# EAGLE design ImageProc2_ver_22 (EAGLE 5.10)
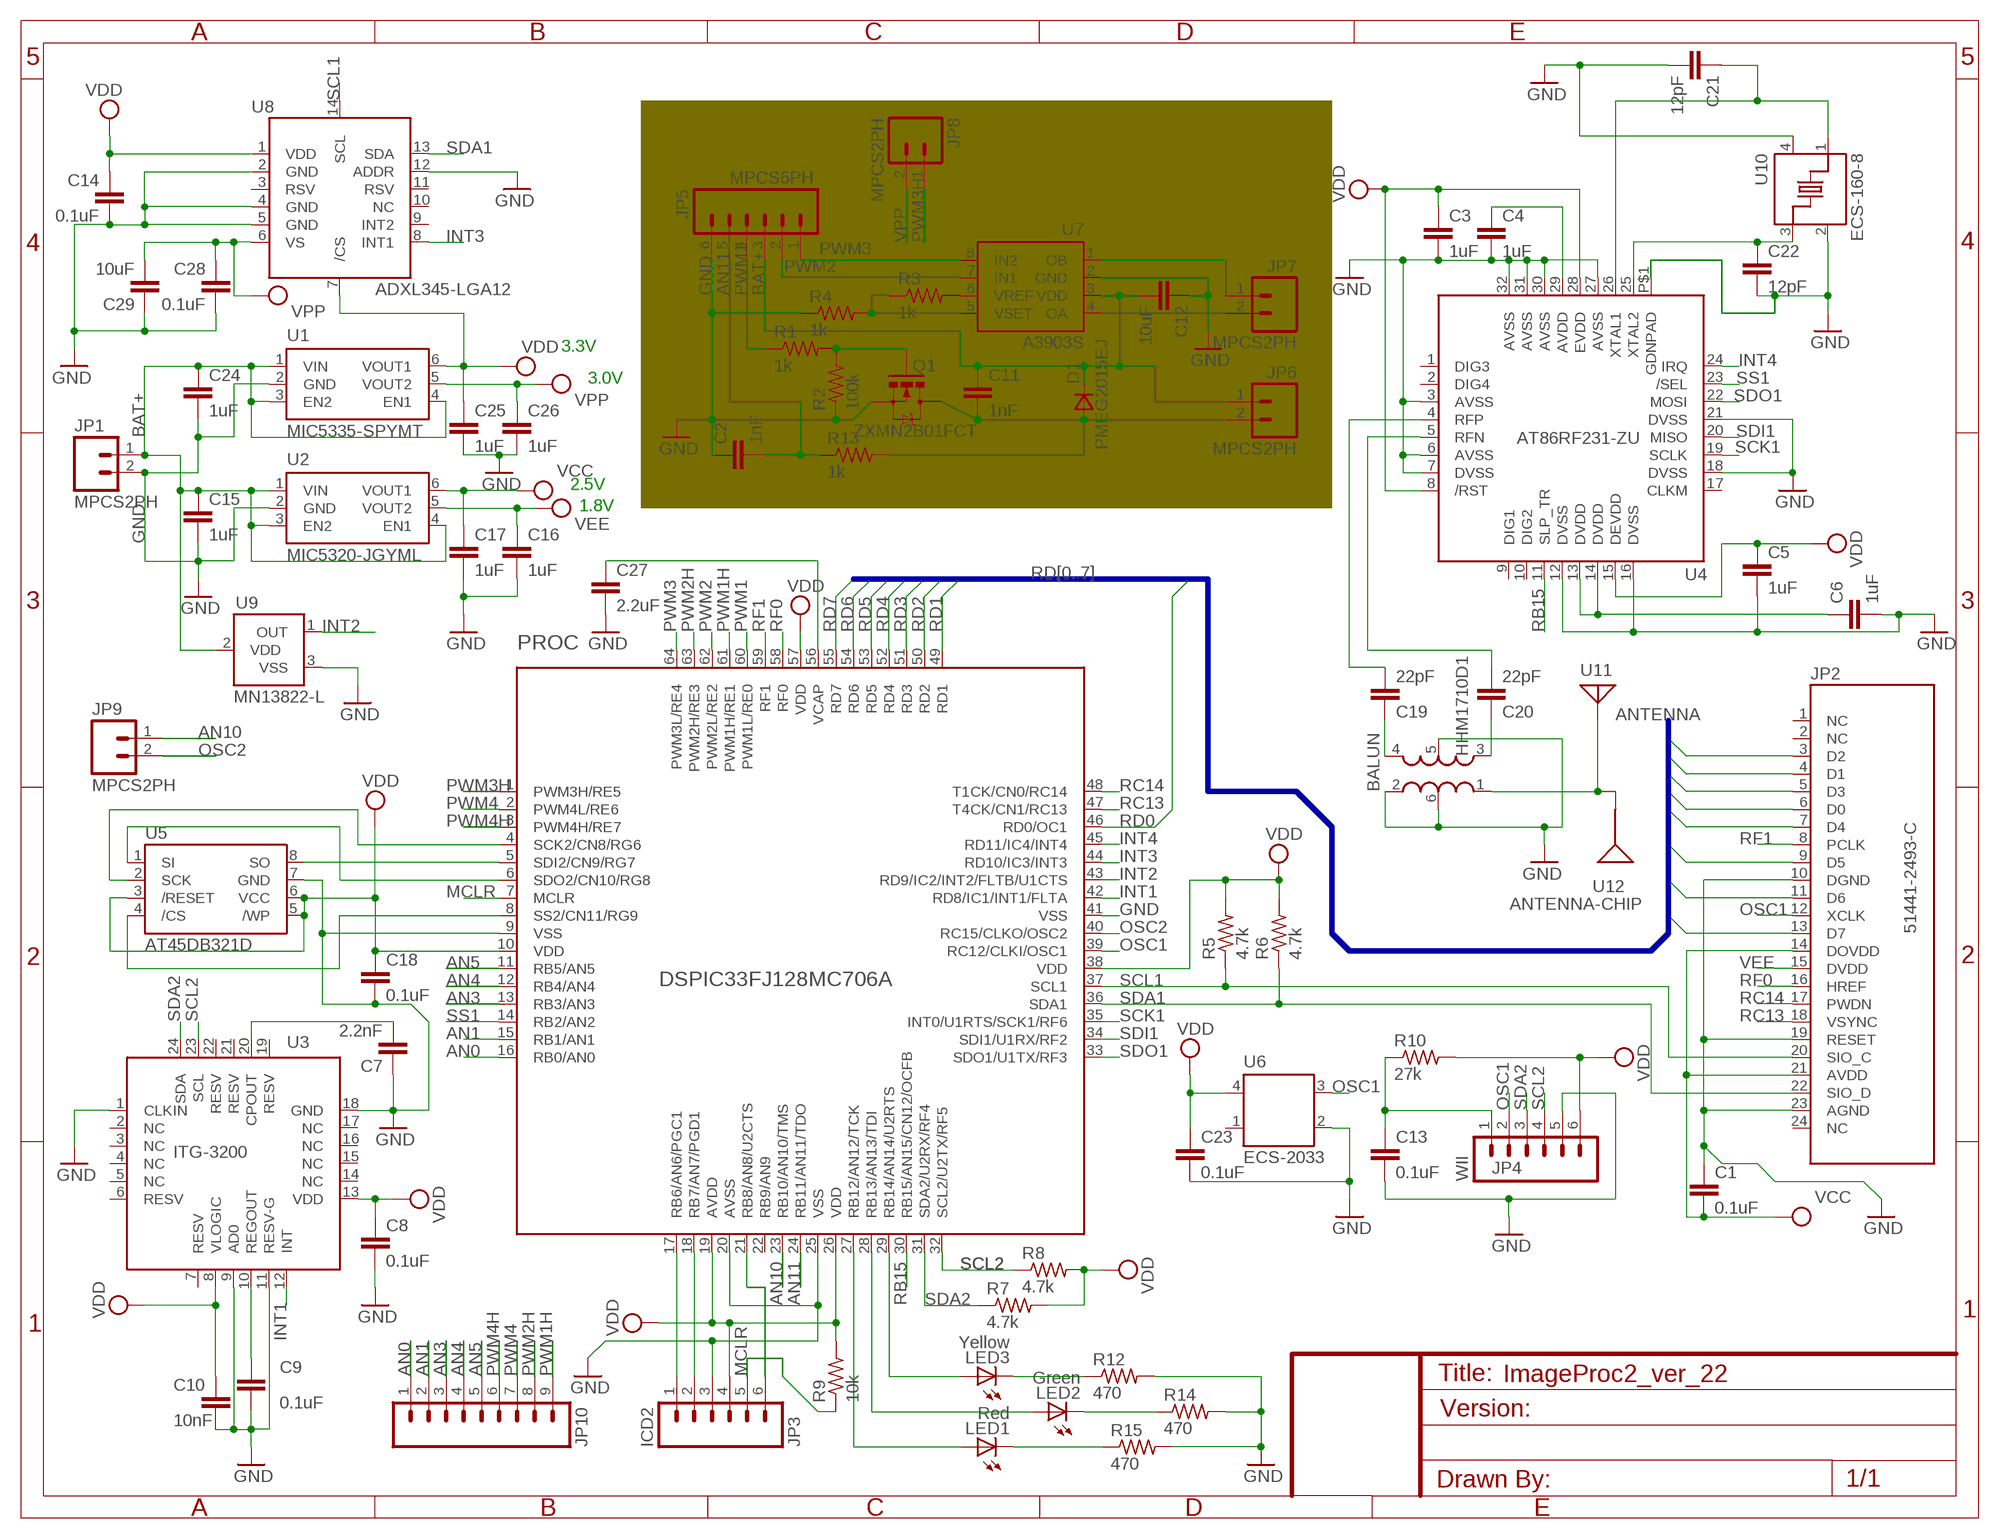
[diagram p0: schematic, sheet 1]

## Parts
BALUN  HHM1710D1  BALUNA  [BALUN]
C1  0.1uF  CAP0402-CAP  [0402-CAP]
C2  1nF  CAP0402-CAP  [0402-CAP]
C3  1uF  CAP0402-CAP  [0402-CAP]
C4  1uF  CAP0402-CAP  [0402-CAP]
C5  1uF  CAP0402-CAP  [0402-CAP]
C6  1uF  CAP0402-CAP  [0402-CAP]
C7  2.2nF  CAP0402-CAP  [0402-CAP]
C8  0.1uF  CAP0402-CAP  [0402-CAP]
C9  0.1uF  CAP0402-CAP  [0402-CAP]
C10  10nF  CAP0402-CAP  [0402-CAP]
C11  1nF  CAP0402-CAP  [0402-CAP]
C12  10uF  CAP0603-CAP  [0603-CAP]
C13  0.1uF  CAP0402-CAP  [0402-CAP]
C14  0.1uF  CAP0402-CAP  [0402-CAP]
C15  1uF  CAP0402-CAP  [0402-CAP]
C16  1uF  CAP0402-CAP  [0402-CAP]
C17  1uF  CAP0402-CAP  [0402-CAP]
C18  0.1uF  CAP0402-CAP  [0402-CAP]
C19  22pF  CAP0402-CAP  [0402-CAP]
C20  22pF  CAP0402-CAP  [0402-CAP]
C21  12pF  CAP0402-CAP  [0402-CAP]
C22  12pF  CAP0402-CAP  [0402-CAP]
C23  0.1uF  CAP0402-CAP  [0402-CAP]
C24  1uF  CAP0402-CAP  [0402-CAP]
C25  1uF  CAP0402-CAP  [0402-CAP]
C26  1uF  CAP0402-CAP  [0402-CAP]
C27  2.2uF  CAP0402-CAP  [0402-CAP]
C28  0.1uF  CAP0402-CAP  [0402-CAP]
C29  10uF  CAP0603-CAP  [0603-CAP]
D1  PMEG2015EJ  DSOD323  [SOD323]
JP1  MPCS2PH  [MOLEX-PICO_CLASP_S2P]
JP2  51441-2493-C  OV7660FSL_CON-24  [MOLEX-52740-2490]
JP3  ICD2  MPCS6PH  [MOLEX-PICO_CLASP_S6P]
JP4  WII  MPCS6PH  [MOLEX-PICO_CLASP_S6P]
JP5  MPCS6PH  [MOLEX-PICO_CLASP_S6P]
JP6  MPCS2PH  [MOLEX-PICO_CLASP_S2P]
JP7  MPCS2PH  [MOLEX-PICO_CLASP_S2P]
JP8  MPCS2PH  [MOLEX-PICO_CLASP_S2P]
JP9  MPCS2PH  [MOLEX-PICO_CLASP_S2P]
JP10  SOLDER_PADS_9P  [SOLDER_PADS_9P]
LED1  Red  LEDCHIP-LED0603  [CHIP-LED0603]
LED2  Green  LEDCHIP-LED0603  [CHIP-LED0603]
LED3  Yellow  LEDCHIP-LED0603  [CHIP-LED0603]
PROC  DSPIC33FJ128MC706A  DSPIC33FJ128MC706-I/PT  [TQFP64]
Q1  ZXMN2B01FCT  MOSFET-NCHANNELSMD  [SOT23-3]
R1  1k  R-US_R0402  [R0402]
R2  100k  R-US_R0402  [R0402]
R3  1k  R-US_R0402  [R0402]
R4  1k  R-US_R0402  [R0402]
R5  4.7k  R-US_R0402  [R0402]
R6  4.7k  R-US_R0402  [R0402]
R7  4.7k  R-US_R0402  [R0402]
R8  4.7k  R-US_R0402  [R0402]
R9  10k  R-US_R0402  [R0402]
R10  27k  R-US_R0402  [R0402]
R12  470  R-US_R0402  [R0402]
R13  1k  R-US_R0402  [R0402]
R14  470  R-US_R0402  [R0402]
R15  470  R-US_R0402  [R0402]
U1  MIC5335-SPYMT  MIC5320-JGYML  [MLF-6]
U2  MIC5320-JGYML  [MLF-6]
U3  ITG-3200  ITG-3200-00  [QFN-24]
U4  AT86RF231-ZU  [QFN-32]
U5  AT45DB321D  [MLF(VDFN)-8]
U6  ECS-2033  OSCILLATORS  [OSCILLATOR-SMD]
U7  A3903S  [DFN-8]
U8  ADXL345-LGA12  ADXL345  [LGA14]
U9  MN13822-L  VOL_DETECTOR  [SOT-23-3]
U10  ECS-160-8  CRYSTALS  [CRYSTAL-SMD]
U11  ANTENNA  [ANTENNA_PAD]
U12  ANTENNA-CHIP  [ANTENNA-CHIP]

## Nets
AN0: JP10.1 PROC.16(RB0/AN0)
AN1: JP10.2 PROC.15(RB1/AN1)
AN3: JP10.3 PROC.13(RB3/AN3)
AN4: JP10.4 PROC.12(RB4/AN4)
AN5: JP10.5 PROC.11(RB5/AN5)
AN10: JP9.1 PROC.23(RB10/AN10/TMS)
AN11: C2.2 JP5.5 PROC.24(RB11/AN11/TDO) R13.1
BAT+ [sup]: C11.1 C12.2 C15.1 C24.1 D1.1(C) JP1.1 JP5.3 JP6.1 U1.1(VIN) U1.3(EN2) U1.4(EN1) U2.1(VIN) U2.3(EN2) U2.4(EN1) U7.3(VDD) U9.2(VDD)
GND [sup]: BALUN.2(RFGND) BALUN.5(GND) BALUN.6(NC) C1.1 C2.1 C3.2 C4.2 C5.2 C6.2 C7.1 C8.2 C9.2 C10.2 C12.1 C13.2 C14.2 C15.2 C16.2 C17.2 C18.2 C21.2 C22.2 C23.2 C24.2 C25.2 C26.2 C27.2 C28.2 C29.1 JP1.2 JP2.10(DGND) JP2.19(RESET) JP2.23(AGND) JP3.3 JP4.5 JP5.6 PROC.9(VSS) PROC.20(AVSS) PROC.25(VSS) PROC.41(VSS) Q1.2(S) R2.1 R4.1 R12.2 R14.2 R15.2 U1.2(GND) U2.2(GND) U3.1(CLKIN) U3.9(AD0) U3.11(RESV-G) U3.18(GND) U4.3(AVSS) U4.6(AVSS) U4.7(DVSS) U4.12(DVSS) U4.16(DVSS) U4.18(DVSS) U4.21(DVSS) U4.27(AVSS) U4.30(AVSS) U4.31(AVSS) U4.32(AVSS) U4.P$1(GDNPAD) U5.7(GND) U6.2(GND) U7.2(GND) U8.2(GND) U8.4(GND) U8.5(GND) U8.12(ADDR) U9.3(VSS) U10.2(GND) U10.4(GND)
INT1: PROC.42(RD8/IC1/INT1/FLTA) U3.12(INT)
INT2: PROC.43(RD9/IC2/INT2/FLTB/U1CTS) U9.1(OUT)
INT3: PROC.44(RD10/IC3/INT3) U8.8(INT1)
INT4: PROC.45(RD11/IC4/INT4) U4.24(IRQ)
MCLR: JP3.5 PROC.7(MCLR) R9.1
N$1: C27.1 PROC.56(VCAP)
N$2: PROC.6(SDO2/CN10/RG8) U5.1(SI)
N$3: LED3.C R12.1
N$6: LED3.A PROC.29(RB14/AN14/U2RTS)
N$7: LED2.C R14.1
N$8: LED1.C R15.1
N$9: LED2.A PROC.28(RB13/AN13/TDI)
N$11: LED1.A PROC.27(RB12/AN12/TCK)
N$14: Q1.1(G) R1.2 R2.2
N$16: C11.2 D1.2(A) JP6.2 Q1.3(D) R13.2
N$19: JP7.1 U7.1(OB)
N$20: JP7.2 U7.4(OA)
N$21: JP3.1 PROC.17(RB6/AN6/PGC1)
N$23: C4.1 U4.29(AVDD)
N$24: JP3.2 PROC.18(RB7/AN7/PGD1)
N$25: R3.2 U7.6(VREF)
N$26: R3.1 R4.2 U7.5(VSET)
N$28: C6.1 U4.13(DVDD) U4.14(DVDD)
N$29: C7.2 U3.20(CPOUT)
N$32: C9.1 U3.10(REGOUT)
N$42: PROC.4(SCK2/CN8/RG6) U5.2(SCK)
N$43: BALUN.4(BAL4) C19.1
N$45: PROC.5(SDI2/CN9/RG7) U5.8(SO)
N$46: BALUN.3(BAL3) C20.1
N$47: C19.2 U4.4(RFP)
N$48: PROC.8(SS2/CN11/RG9) U5.4(/CS)
N$49: C20.2 U4.5(RFN)
N$50: C22.1 U4.25(XTAL2) U10.3(IN/OUT)
N$51: C21.1 U4.26(XTAL1) U10.1(IN/OUT)
N$52: BALUN.1(UNBAL) U11.P$1 U12.SIG(SIGNAL)
N$57: C13.1 JP4.1 R10.1
N$62: JP3.6 PROC.21(RB8/AN8/U2CTS)
OSC1: JP2.12(XCLK) JP4.2 PROC.39(RC12/CLKI/OSC1) U6.3(OUT)
OSC2: JP9.2 PROC.40(RC15/CLKO/OSC2)
PWM1: JP5.4 PROC.60(PWM1L/RE0) R1.1
PWM1H: JP10.9 PROC.61(PWM1H/RE1)
PWM2: JP5.2 PROC.62(PWM2L/RE2) U7.7(IN1)
PWM2H: JP10.8 PROC.63(PWM2H/RE3)
PWM3: JP5.1 PROC.64(PWM3L/RE4) U7.8(IN2)
PWM3H: JP8.1 PROC.1(PWM3H/RE5)
PWM4: JP10.7 PROC.2(PWM4L/RE6)
PWM4H: JP10.6 PROC.3(PWM4H/RE7)
RB15: PROC.30(RB15/AN15/CN12/OCFB) U4.11(SLP_TR)
RC13: JP2.18(VSYNC) PROC.47(T4CK/CN1/RC13)
RC14: JP2.17(PWDN) PROC.48(T1CK/CN0/RC14)
RD0: JP2.6(D0) PROC.46(RD0/OC1)
RD1: JP2.4(D1) PROC.49(RD1)
RD2: JP2.3(D2) PROC.50(RD2)
RD3: JP2.5(D3) PROC.51(RD3)
RD4: JP2.7(D4) PROC.52(RD4)
RD5: JP2.9(D5) PROC.53(RD5)
RD6: JP2.11(D6) PROC.54(RD6)
RD7: JP2.13(D7) PROC.55(RD7)
RF0: JP2.16(HREF) PROC.58(RF0)
RF1: JP2.8(PCLK) PROC.59(RF1)
SCK1: PROC.35(INT0/U1RTS/SCK1/RF6) U4.19(SCLK)
SCL1: JP2.20(SIO_C) PROC.37(SCL1) R5.1 U8.14(SCL)
SCL2: JP4.4 PROC.32(SCL2/U2TX/RF5) R8.1 U3.23(SCL)
SDA1: JP2.22(SIO_D) PROC.36(SDA1) R6.1 U8.13(SDA)
SDA2: JP4.3 PROC.31(SDA2/U2RX/RF4) R7.1 U3.24(SDA)
SDI1: PROC.34(SDI1/U1RX/RF2) U4.20(MISO)
SDO1: PROC.33(SDO1/U1TX/RF3) U4.22(MOSI)
SS1: PROC.14(RB2/AN2) U4.23(/SEL)
VCC: C1.2 C17.1 JP2.14(DOVDD) JP2.21(AVDD) U2.6(VOUT1)
VDD: C3.1 C5.1 C8.1 C10.1 C14.1 C18.1 C23.1 C25.1 JP3.4 JP4.6 PROC.10(VDD) PROC.19(AVDD) PROC.26(VDD) PROC.38(VDD) PROC.57(VDD) R5.2 R6.2 R7.2 R8.2 R9.2 R10.2 U1.6(VOUT1) U3.8(VLOGIC) U3.13(VDD) U4.8(/RST) U4.15(DEVDD) U4.28(EVDD) U5.3(/RESET) U5.5(/WP) U5.6(VCC) U6.4(VDD) U8.1(VDD) U8.7(/CS)
VEE: C16.1 JP2.15(DVDD) U2.5(VOUT2)
VPP: C26.1 C28.1 C29.2 JP8.2 U1.5(VOUT2) U8.6(VS)
Unconnected: JP2.1(NC) JP2.2(NC) JP2.24(NC) PROC.22(RB9/AN9) U3.2(NC) U3.3(NC) U3.4(NC) U3.5(NC) U3.6(RESV) U3.7(RESV) U3.14(NC) U3.15(NC) U3.16(NC) U3.17(NC) U3.19(RESV) U3.21(RESV) U3.22(RESV) U4.1(DIG3) U4.2(DIG4) U4.9(DIG1) U4.10(DIG2) U4.17(CLKM) U6.1(NC) U8.3(RSV) U8.9(INT2) U8.10(NC) U8.11(RSV)

## Buses
RD[0..7]

## Notes on the sheet
- 3.3V
- 3.0V
- 2.5V
- 1.8V

## Library data of the parts
BALUN = stan:BALUN
C1-C29 = SparkFun:CAP: Capacitor Standard 0603 ceramic capacitor, and 0.1" leaded capacitor.
D1 = zetex:D: DIODE
JP1 JP6-JP9 = stan:MPCS2P: Molex Pico-Clasp Single Row 2 POS
JP2 = stan:OV7660FSL_CON
JP3-JP5 = stan:MPCS6P: Molex Pico-Clasp Single Row 6 Pos
JP10 = stan:SOLDER_PADS_9P
LED1-LED3 = led:LED: LED OSRAM: - CHIPLED LG R971, LG N971, LY N971, LG Q971, LY Q971, LO R971, LY R971 LH N974, LH R974 LS Q976, LO Q976, LY Q976 LO Q996 - Hyper CHIPLED LW Q18S LB Q993, LB Q99A, LB R99A - SideLED LS A670, LO A670, LY A670, LG A670, LP A670 LB A673, LV A673, LT A673, LW A673 LH A674 LY A675 LS A676, LA A676, LO A676, LY A676, LW A676 LS A679, LY A679, LG A679 - Hyper Micro SIDELED® LS Y876, LA Y876, LO Y876, LY Y876 LT Y87S - SmartLED LW L88C, LW L88S LB L89C, LB L89S, LG L890 LS L89K, LO L89K, LY L89K LS L896, LA L896, LO L896, LY L896 - TOPLED LS T670, LO T670, LY T670, LG T670, LP T670 LSG T670, LSP T670, LSY T670, LOP T670, LYG T670 LG T671, LOG T671, LSG T671 LB T673, LV T673, LT T673, LW T673 LH T674 LS T676, LA T676, LO T676, LY T676, LB T676, LH T676, LSB T676, LW T676 LB T67C, LV T67C, LT T67C, LS T67K, LO T67K, LY T67K, LW E67C LS E67B, LA E67B, LO E67B, LY E67B, LB E67C, LV E67C, LT E67C LW T67C LS T679, LY T679, LG T679 LS T770, LO T770, LY T770, LG T770, LP T770 LB T773, LV T773, LT T773, LW T773 LH T774 LS E675, LA E675, LY E675, LS T675 LS T776, LA T776, LO T776, LY T776, LB T776 LHGB T686 LT T68C, LB T68C - Hyper Mini TOPLED® LB M676 - Mini TOPLED Santana® LG M470 LS M47K, LO M47K, LY M47K Source: http://www.osram.convergy.de LUXEON: - LUMILED® LXK2-PW12-R00, LXK2-PW12-S00, LXK2-PW14-U00, LXK2-PW14-V00 LXK2-PM12-R00, LXK2-PM12-S00, LXK2-PM14-U00 LXK2-PE12-Q00, LXK2-PE12-R00, LXK2-PE12-S00, LXK2-PE14-T00, LXK2-PE14-U00 LXK2-PB12-K00, LXK2-PB12-L00, LXK2-PB12-M00, LXK2-PB14-N00, LXK2-PB14-P00, LXK2-PB14-Q00 LXK2-PR12-L00, LXK2-PR12-M00, LXK2-PR14-Q00, LXK2-PR14-R00 LXK2-PD12-Q00, LXK2-PD12-R00, LXK2-PD12-S00 LXK2-PH12-R00, LXK2-PH12-S00 LXK2-PL12-P00, LXK2-PL12-Q00, LXK2-PL12-R00 Source: www.luxeon.com KINGBRIGHT: KA-3528ASYC Source: www.kingbright.com
PROC = stan:DSPIC33FJ128MC706: Microchip dsPIC33FJ128MC706
Q1 = SparkFun:MOSFET-NCHANNEL
R1-R10 R12-R15 = rcl:R-US_: RESISTOR, American symbol
U1 U2 = stan:MIC5320: MIC5320 High Performance Dual 150mA Voltage Regulator Package: NOT VERIFIED
U3 = stan:ITG-3200: Invensense 3-axis Gyroscope Package: NOT VERIFIED YET
U4 = stan:AT86RF231: Atmel 2.4GHz transceiver for Zigbee
U5 = stan:AT45DB: Atmel DataFlash AT45DB Series Package: NOT VERIFIED
U6 = stan:OSCILLATOR
U7 = stan:A3903: Allegro Low Voltage DC Motor Driver (A3903) Package: DFN-8
U8 = stan:ADXL345
U9 = stan:VOL_DETECTOR
U10 = stan:CRYSTAL
U11 = stan:ANTENNA
U12 = stan:ANTENNA-CHIP

## Net classes
1 sup: width 0.254 mm

## Board
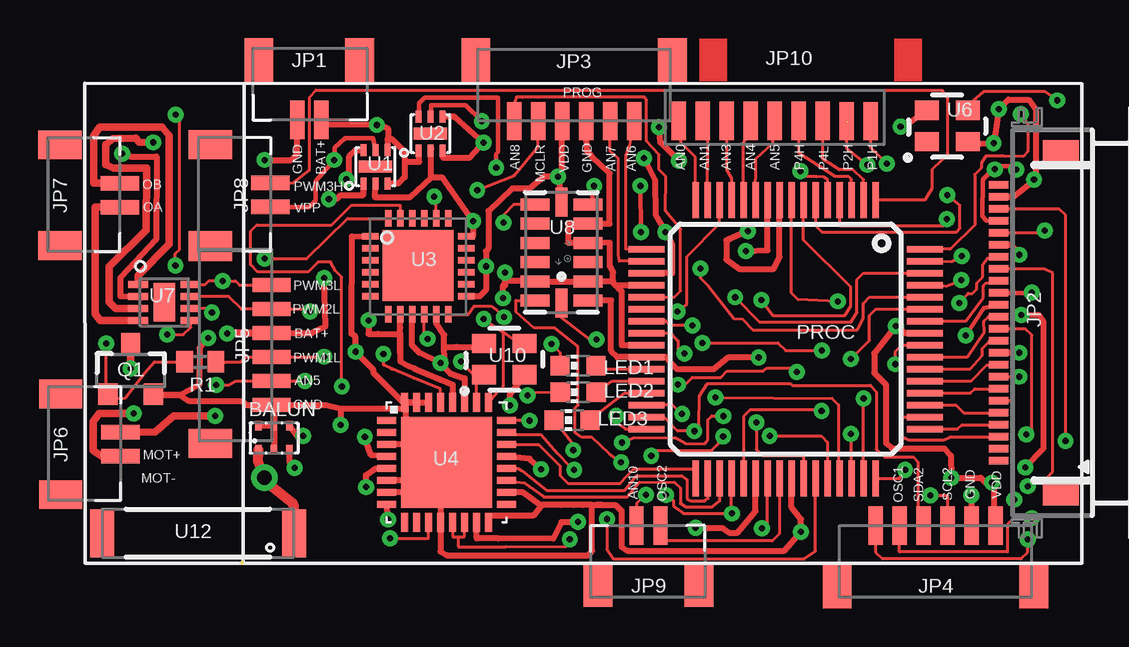
[diagram p1: board, top side]
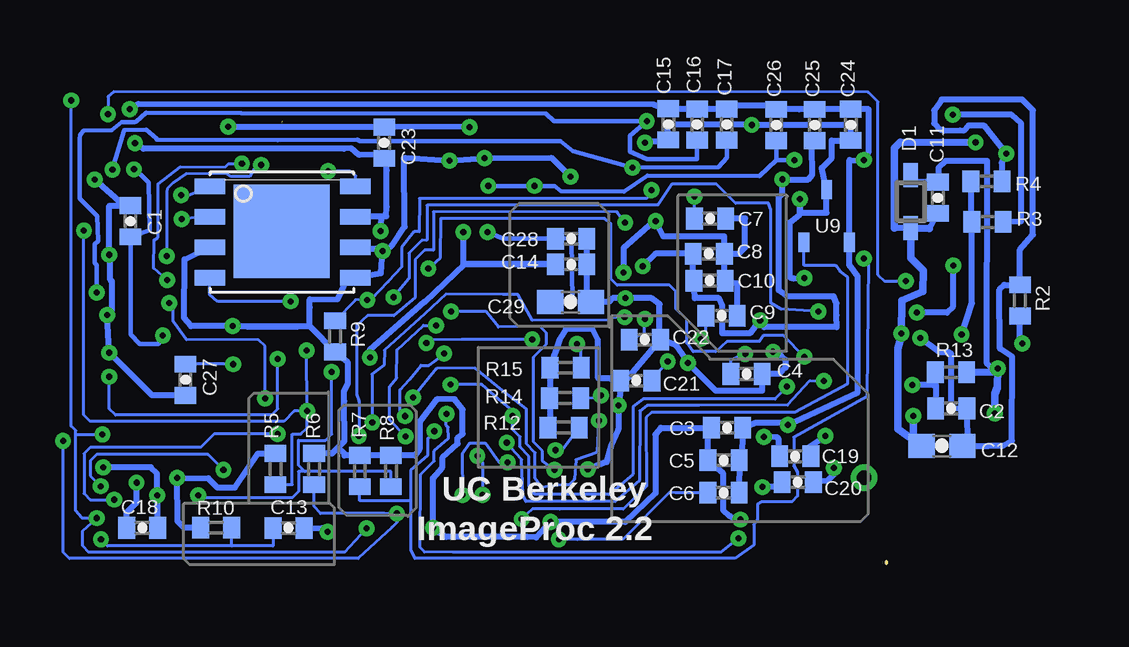
[diagram p2: board, bottom side, seen from below]

Size 0.01 x 0.06 mm. Coordinates in mm from the lower left corner, seen from the top.
Outline: 0.01,0.01 0,0.01
Outline: 0,0.01 0,0
Outline: 0,0.01 0,0.06
Copper layers (1*16): Top 0.035mm / dielectric 1.5mm / Bottom 0.035mm
Design rules "default *": minimum track width 5mil, minimum drill 10mil, track to track 5mil, track to pad 5mil, pad to pad 5mil, via to via 5mil, smd to smd 5mil, copper to edge 5mil, drill to drill 5mil, minimum pad ring 10mil, minimum via ring 8mil, stop-mask expansion 4mil, vias tented up to drill 27mil, thermal gap 10mil

### Footprints (pad centres in the part's own frame; a part is rotated, then mirrored left to right if it is on the bottom)
BALUN = smd 0.27 x 0.4: 1 -0.7,-0.5; 2 -0.05,-0.5; 3 0.6,-0.5; 4 0.6,0.5; 5 -0.05,0.5; 6 -0.7,0.5
0402-CAP = smd 0.7 x 0.9: 1 -0.65,0; 2 0.65,0
0603-CAP = smd 1.1 x 1: 1 -0.85,0; 2 0.85,0
SOD323 = smd 1 x 0.6: 1 -1.1,0; 2 1.1,0
MOLEX-PICO_CLASP_S2P = smd 0.6 x 1.6: 1 -0.5,1; 2 0.5,1 | smd 1.2 x 1.8: A -2.1,-1.5; B 2.1,-1.5
MOLEX-52740-2490 = smd 0.3 x 0.8: 1 -5.75,2.5; 2 -5.25,2.5; 3 -4.75,2.5; 4 -4.25,2.5; 5 -3.75,2.5; 6 -3.25,2.5; 7 -2.75,2.5; 8 -2.25,2.5; 9 -1.75,2.5; 10 -1.25,2.5; 11 -0.75,2.5; 12 -0.25,2.5; 13 0.25,2.5; 14 0.75,2.5; 15 1.25,2.5; 16 1.75,2.5; 17 2.25,2.5; 18 2.75,2.5; 19 3.25,2.5; 20 3.75,2.5; 21 4.25,2.5; 22 4.75,2.5; 23 5.25,2.5; 24 5.75,2.5 | smd 0.85 x 1.5: P$1 -7.18,-0.1; P$2 7.18,-0.1
MOLEX-PICO_CLASP_S6P = smd 0.6 x 1.6: 1 -2.5,1; 2 -1.5,1; 3 -0.5,1; 4 0.5,1; 5 1.5,1; 6 2.5,1 | smd 1.2 x 1.8: A -4.1,-1.55; B 4.1,-1.55
SOLDER_PADS_9P = smd 0.6 x 1.6: 1 -2.5,0.365; 2 -1.5,0.365; 3 -0.5,0.365; 4 0.5,0.365; 5 1.5,0.365; 6 2.5,0.365; 7 3.5,0.365; 8 4.5,0.35; 9 5.5,0.35
CHIP-LED0603 = smd 0.8 x 0.8: A 0,-0.75; C 0,0.75
TQFP64 = smd 1.5 x 0.28: 1 -5.8,3.75; 2 -5.8,3.25; 3 -5.8,2.75; 4 -5.8,2.25; 5 -5.8,1.75; 6 -5.8,1.25; 7 -5.8,0.75; 8 -5.8,0.25; 9 -5.8,-0.25; 10 -5.8,-0.75; 11 -5.8,-1.25; 12 -5.8,-1.75; 13 -5.8,-2.25; 14 -5.8,-2.75; 15 -5.8,-3.25; 16 -5.8,-3.75; 33 5.8,-3.75; 34 5.8,-3.25; 35 5.8,-2.75; 36 5.8,-2.25; 37 5.8,-1.75; 38 5.8,-1.25; 39 5.8,-0.75; 40 5.8,-0.25; 41 5.8,0.25; 42 5.8,0.75; 43 5.8,1.25; 44 5.8,1.75; 45 5.8,2.25; 46 5.8,2.75; 47 5.8,3.25; 48 5.8,3.75 | smd 0.28 x 1.5: 17 -3.75,-5.8; 18 -3.25,-5.8; 19 -2.75,-5.8; 20 -2.25,-5.8; 21 -1.75,-5.8; 22 -1.25,-5.8; 23 -0.75,-5.8; 24 -0.25,-5.8; 25 0.25,-5.8; 26 0.75,-5.8; 27 1.25,-5.8; 28 1.75,-5.8; 29 2.25,-5.8; 30 2.75,-5.8; 31 3.25,-5.8; 32 3.75,-5.8; 49 3.75,5.8; 50 3.25,5.8; 51 2.75,5.8; 52 2.25,5.8; 53 1.75,5.8; 54 1.25,5.8; 55 0.75,5.8; 56 0.25,5.8; 57 -0.25,5.8; 58 -0.75,5.8; 59 -1.25,5.8; 60 -1.75,5.8; 61 -2.25,5.8; 62 -2.75,5.8; 63 -3.25,5.8; 64 -3.75,5.8
SOT23-3 = smd 0.8 x 0.9: 1 -0.95,-1; 2 0.95,-1; 3 0,1.1
R0402 = smd 0.7 x 0.9: 1 -0.65,0; 2 0.65,0
MLF-6 = smd 0.25 x 0.5: 1 -0.5,-0.7; 2 0,-0.7; 3 0.5,-0.7; 4 0.5,0.7; 5 0,0.7; 6 -0.5,0.7 | smd 1.4 x 0.5: P$1 0,0
QFN-24 = smd 0.7 x 0.275: 1 -2,1.25; 2 -2,0.75; 3 -2,0.25; 4 -2,-0.25; 5 -2,-0.75; 6 -2,-1.25; 13 2,-1.25; 14 2,-0.75; 15 2,-0.25; 16 2,0.25; 17 2,0.75; 18 2,1.25 | smd 0.275 x 0.7: 7 -1.25,-2; 8 -0.75,-2; 9 -0.25,-2; 10 0.25,-2; 11 0.75,-2; 12 1.25,-2; 19 1.25,2; 20 0.75,2; 21 0.25,2; 22 -0.25,2; 23 -0.75,2; 24 -1.25,2 | smd 2.95 x 2.95: 25 -0.01,0.03
QFN-32 = smd 0.8 x 0.3: 1 -2.5,1.75; 2 -2.5,1.25; 3 -2.5,0.75; 4 -2.5,0.25; 5 -2.5,-0.25; 6 -2.5,-0.75; 7 -2.5,-1.25; 8 -2.5,-1.75; 17 2.5,-1.75; 18 2.5,-1.25; 19 2.5,-0.75; 20 2.5,-0.25; 21 2.5,0.25; 22 2.5,0.75; 23 2.5,1.25; 24 2.5,1.75 | smd 0.3 x 0.8: 9 -1.75,-2.5; 10 -1.25,-2.5; 11 -0.75,-2.5; 12 -0.25,-2.5; 13 0.25,-2.5; 14 0.75,-2.5; 15 1.25,-2.5; 16 1.75,-2.5; 25 1.75,2.5; 26 1.25,2.5; 27 0.75,2.5; 28 0.25,2.5; 29 -0.25,2.5; 30 -0.75,2.5; 31 -1.25,2.5; 32 -1.75,2.5 | smd 3.8 x 3.8: P$1 0,0.001
MLF(VDFN)-8 = smd 1.27 x 0.635: 1 0,4.31; 2 0,3.04; 3 0,1.77; 4 0,0.5; 5 6.05,0.5; 6 6.05,1.77; 7 6.05,3.04; 8 6.05,4.31 | smd 4 x 3.9: P$1 2.991,2.44
OSCILLATOR-SMD = smd 1 x 0.8: 1 -0.85,-0.65; 2 0.85,-0.65; 3 0.85,0.65; 4 -0.85,0.65
DFN-8 = smd 0.3 x 0.83: 1 -0.75,-1.1; 2 -0.25,-1.1; 3 0.25,-1.1; 4 0.75,-1.1; 5 0.75,1.1; 6 0.25,1.1; 7 -0.25,1.1; 8 -0.75,1.1 | smd 1.6 x 0.9: 9 0,0
LGA14 = smd 0.5 x 1.2: 1 2,1.1; 2 1.2,1.1; 3 0.4,1.1; 4 -0.4,1.1; 5 -1.2,1.1; 6 -2,1.1; 8 -2,-1.1; 9 -1.2,-1.1; 10 -0.4,-1.1; 11 0.4,-1.1; 12 1.2,-1.1; 13 2,-1.1 | smd 1.2 x 0.5: 7 -2.1,0; 14 2.1,0
SOT-23-3 = smd 0.45 x 0.8: 1 0.2,0.4; 2 1.15,2.6; 3 2.1,0.4
CRYSTAL-SMD = smd 1 x 0.8: 1 -0.85,-0.65; 2 0.85,-0.65; 3 0.85,0.65; 4 -0.85,0.65
ANTENNA_PAD = drill 0.6 round: P$1 0,0
ANTENNA-CHIP = smd 1 x 2: NC 4,0; SIG -4,0

### Placement (x,y rotation side)
BALUN  1.37,5.24 0 top  (outside the outline)
C1  31.5,14.27 270 bottom  (outside the outline)
C2  -2.71,6.46 180 bottom  (outside the outline)
C3  6.63,5.66 0 bottom  (outside the outline)
C4  5.82,7.9 0 bottom  (outside the outline)
C5  6.78,4.31 0 bottom  (outside the outline)
C6  6.78,2.95 0 bottom  (outside the outline)
C7  7.34,14.38 180 bottom  (outside the outline)
C8  7.4,12.92 0 bottom  (outside the outline)
C9  6.86,10.33 0 bottom  (outside the outline)
C10  7.36,11.79 0 bottom  (outside the outline)
C11  -2.15,15.25 90 bottom  (outside the outline)
C12  -2.32,4.91 180 bottom  (outside the outline)
C13  24.91,1.48 0 bottom  (outside the outline)
C14  13.13,12.47 0 bottom  (outside the outline)
C15  9.08,18.31 90 bottom  (outside the outline)
C16  7.88,18.3 90 bottom  (outside the outline)
C17  6.64,18.3 90 bottom  (outside the outline)
C18  31.01,1.49 0 bottom  (outside the outline)
C19  3.79,4.47 180 bottom  (outside the outline)
C20  3.68,3.39 180 bottom  (outside the outline)
C21  10.42,7.63 180 bottom  (outside the outline)
C22  10.06,9.33 0 bottom  (outside the outline)
C23  20.93,17.54 270 bottom  (outside the outline)
C24  1.48,18.29 90 bottom  (outside the outline)
C25  2.98,18.28 90 bottom  (outside the outline)
C26  4.58,18.29 90 bottom  (outside the outline)
C27  29.21,7.66 270 bottom  (outside the outline)
C28  13.13,13.54 0 bottom  (outside the outline)
C29  13.16,10.91 180 bottom  (outside the outline)
D1  -1.02,15.09 90 bottom  (outside the outline)
JP1  2.79,19.49 180 top  (outside the outline)
JP2  34.02,10.04 90 top  (outside the outline)
JP3  13.83,19.45 180 top  (outside the outline)
JP4  28.89,0.58 0 top  (outside the outline)
JP5  0.22,9.11 270 top  (outside the outline)
JP6  -6.08,4.97 270 top  (outside the outline)
JP7  -6.1,15.36 270 top  (outside the outline)
JP8  0.17,15.37 270 top  (outside the outline)
JP9  16.93,0.59 0 top  (outside the outline)
JP10  20.69,18.09 0 top  (outside the outline)
LED1  13.99,8.24 90 top  (outside the outline)
LED2  14,7.14 90 top  (outside the outline)
LED3  13.74,5.98 90 top  (outside the outline)
PROC  22.65,9.35 270 top  (outside the outline)
Q1  -4.66,8.05 0 top  (outside the outline)
R1  -1.75,8.41 180 top  (outside the outline)
R2  -5.57,10.97 270 bottom  (outside the outline)
R3  -4.22,14.24 0 bottom  (outside the outline)
R4  -4.18,15.93 180 bottom  (outside the outline)
R5  25.46,3.94 90 bottom  (outside the outline)
R6  23.85,3.94 90 bottom  (outside the outline)
R7  21.94,3.85 90 bottom  (outside the outline)
R8  20.64,3.85 90 bottom  (outside the outline)
R9  22.97,9.47 270 bottom  (outside the outline)
R10  27.93,1.49 180 bottom  (outside the outline)
R12  13.45,5.67 180 bottom  (outside the outline)
R13  -2.7,7.97 0 bottom  (outside the outline)
R14  13.38,6.9 180 bottom  (outside the outline)
R15  13.37,8.16 180 bottom  (outside the outline)
U1  5.54,16.54 0 top  (outside the outline)
U2  7.83,17.92 0 top  (outside the outline)
U3  7.33,12.39 0 top  (outside the outline)
U4  8.51,4.21 0 top  (outside the outline)
U5  28.18,11.42 0 bottom  (outside the outline)
U6  29.38,18.24 0 top  (outside the outline)
U7  -3.25,10.89 270 top  (outside the outline)
U8  13.3,12.97 270 top  (outside the outline)
U9  3.64,12.99 0 bottom  (outside the outline)
U10  10.92,8.52 0 top  (outside the outline)
U11  0.92,3.57 0 top  (outside the outline)
U12  -1.85,1.26 180 top

### Tracks (layer width: path | path; a pad name or v marks a point on that pad's centre or on a via)
AN0
  Top 0.127: PROC.16 18.89,16.63 18.89,16.95 18.29,17.55 JP10.1
AN1
  Top 0.127: PROC.15 19.41,17.87 JP10.2
AN3
  Top 0.127: PROC.13 20.4,16.05 20.21,16.39 JP10.3
AN4
  Top 0.127: PROC.12 20.89,17.57 21.08,17.79 JP10.4
AN5
  Top 0.127: PROC.11 21.4,16.88 22.11,17.54 JP10.5
AN10  (via drill 0.25 pad 0.66)
  Top 0.127: PROC.23 17.64,10.12 17.86,9.92 v18.76,9.93 | v20.04,5.29 19.81,4.96 19.56,4.71 17.3,4.71 v17.04,4.48 | JP9.1 16.44,2.02 16.44,2.1 16.45,2.25 16.45,2.52 v16.83,2.86
  Bottom 0.127: v18.76,9.93 19.29,9.93 20.4,8.91 20.41,7.74 20.7,7.38 20.7,5.98 v20.04,5.29 | v16.83,2.86 16.83,4.14 16.84,4.35 v17.04,4.48
AN11  (via drill 0.25 pad 0.66)
  Top 0.127: v-1.09,7.44 -0.58,7.44 -0.28,7.61 | -0.28,7.61 | -0.28,7.61 JP5.5 v2.6,7.62 | v15.82,5.04 16.32,5.25 18.06,5.24 18.15,5.19 18.48,5 19.25,4.99 19.41,5.18 19.41,5.99 19.57,6.16 v20.05,6.14 | PROC.24 17.82,9.61 17.86,9.61 18.16,9.28 18.16,8.94 v18.43,8.76
  Bottom 0.127: v-1.09,7.44 -1.24,7.42 -2,7.41 | v2.6,7.62 3.17,7.63 4.12,6.6 7.79,6.6 9.96,6.6 10.27,6.37 10.28,3.47 11.3,2.58 15.02,2.58 15.15,2.87 15.2,4.33 v15.82,5.04 | v18.43,8.76 18.66,8.56 18.83,8.42 19.05,8.27 19.39,8.27 19.88,7.67 20.27,7.24 20.27,6.32 v20.05,6.14
  Bottom 0.254: -2,7.41 R13.1 | v-1.09,7.44 -2.09,7.44 C2.2
BAT+  (via drill 0.25 pad 0.66)
  Top 0.254: U2.4 8.84,18.62 v10.05,17.55 9.46,16.91 8.37,16.91 U2.3 | -0.61,9.61 -0.61,9.63 -0.52,9.61 v-0.63,9.59 | 6.77,16.76 7.37,16.76 U2.1 | 6.77,16.76 6.77,16.11 6.5,15.84 U1.3 | JP1.1 3.39,18.4 3.37,18.28 v5.61,18.29 5.77,18.28 6.07,18.14 6.07,17.7 6.25,17.69 | 6.25,17.69 6.04,17.69 U1.4 | 6.77,16.76 6.77,17.17 6.25,17.69 | v3.6,15.2 3.92,15.2 4.09,15.36 5.04,15.37 U1.1 | -5.36,16.49 -5.34,16.48 | JP5.3 2.89,9.61 3.46,9.89 v3.4,11.9
  Top 0.305: -0.61,9.61 JP5.3 | v-3.72,17.56 -4.3,17.57 -4.45,17.73 -5.38,17.72 -5.71,17.47 -5.71,16.63 -5.36,16.49 | -5.34,16.48 -3.99,16.48 -4,13.91 -5.54,12.37 -5.54,10.9 -5.28,10.64 U7.3 | v-1.13,6.16 -2.87,6.16 -3.63,5.49 -5.48,5.47 JP6.1
  Bottom 0.254: 3.6,14.99 3.59,14.62 2.48,14.62 U9.2 2.69,16.49 2.27,16.91 2.27,17.64 C24.1 1.48,18.28 5.59,18.28 5.63,18.28 v5.61,18.29 9.16,18.29 C15.1 9.16,17.58 10.01,17.58 v10.05,17.55 | v3.4,11.9 3.85,11.89 4,11.93 4,14.21 3.6,14.55 3.6,14.99 | -0.56,9.26 -0.65,9.61 | -1.79,13.97 C11.1 | -0.65,9.61 -0.66,9.59 v-0.64,9.58 -0.61,9.58 v-0.63,9.59 | 3.6,14.99 v3.6,15.2 | -0.65,10.93 -0.66,10.96 | -0.65,9.61 -0.64,9.62 | D1.1 -0.35,13.99
  Bottom 0.305: -0.56,9.26 -0.48,8.97 -0.47,5.62 C12.2 -1.12,5.2 -1.14,5.71 v-1.13,6.16 | -1.79,13.97 D1.1 -1.02,12.74 -1.54,12.21 -1.53,11.34 -0.66,10.96 | -0.64,9.62 -0.65,10.93 | -0.35,13.99 -0.35,17.33 -0.58,17.57 v-3.72,17.56
GND  (via drill 0.25, 0.25 pad 0.66)
  Top 0.254: BALUN.5 BALUN.2 | BALUN.5 BALUN.6 | JP5.6 3.49,6.61 4.09,6.46 | 33.07,16.31 33.07,18.92 32.77,19.34 31.93,19.34 v31.54,18.95 v31.32,17.52 30.74,17.49 30.46,17.49 U6.2 | 33.07,16.31 33.07,16.03 32.13,15.29 JP2.23 | 14.58,2.44 14.58,0.53 14.43,0.34 8.5,0.34 8.53,0.35 8.26,0.49 8.26,1.54 | 14.58,2.44 15,2.44 14.71,2.44 15.55,2.44 15.56,2.42 15.81,2.2 15.8,0.69 16.05,0.53 22.6,0.53 v23.29,1.32 23.29,1.85 22.9,2.34 PROC.41 | v-5,17.1 -4.6,16.96 -3.57,16.97 -3.59,13.5 -5.05,11.94 -5.08,11.91 -5.08,11.15 U7.2 | BALUN.5 1.3,6.58 1.25,6.58 JP5.6 | 7.86,16.09 8.35,16.09 v9.61,14.27 9.61,13.63 U3.18 | U3.1 4.57,13.65 4.55,9.59 4.71,9.46 v4.71,8.83 5.46,8.08 | PROC.25 15.81,9.1 15.81,11.34 15.55,11.6 | v32.47,10.36 33.17,10.38 33.38,10.1 33.38,4.79 v32.64,4.01 | JP5.6 0.14,6.61 0.01,6.79 -2.24,6.79 -2.61,7.02 -3.38,7.02 -3.48,6.92 Q1.2 -3.43,7.03 -2.59,7.03 -1.8,7.45 -1.79,8.98 -1.54,9.29 -1.56,9.33 v-1.42,9.4 | 13.29,2.44 12.49,2.44 12.13,1.99 11.36,2 10.28,2 U4.16 | 5.46,8.08 | U4.31 6.7,6.71 5.46,7.94 5.46,8.08 | JP3.3 14.36,17.24 14.57,16.96 15.3,16.28 15.3,14.17 U8.5 13.6,14.17 13.6,13.37 U8.4 15.31,13.38 15.31,12.4 15.46,12.13 15.46,11.78 | v0.93,16.83 2.02,16.83 2.29,17.09 JP1.2 | v8.27,8.36 8.33,8.42 8.42,8.52 8.41,9.03 | v8.27,8.36 7.37,8.79 7.08,9.07 | 7.08,9.07 | 7.08,9.07 U3.9 | U4.32 U4.31 | v32.38,12.87 32.38,12.96 32.05,13.29 JP2.19 | U4.32 6.76,6.46 4.54,6.46 4.09,6.46 | U4.32 6.8,6.67 6.8,5.91 7.4,5.31 | 15.46,11.78 15.46,11.69 15.55,11.6 | U4.31 7.66,6.71 U4.30 | 15.46,11.78 14.9,11.78 14.45,11.82 U8.2 U8.12 12.21,11.79 11.02,11.79 v10.95,12.13 10.95,11.59 10.87,11.59 v10.87,11.06
  Top 0.254: 8.41,9.03 8.93,9.03 9.68,9.04 U10.4 | 4.09,6.46 v4.09,5.78 | 13.29,2.44 12.41,2.44 11.7,2.96 11.68,2.96 U4.18 | v8.27,8.36 8.67,7.92 9.26,7.72 U4.27 | v11.16,6.59 11.15,7.04 11.31,7.26 U10.2 | 8.41,9.03 8.41,9.52 8.41,9.53 8.09,10 U3.11 | 7.86,16.09 7,15.29 6.98,15.27 5.53,15.27 U1.2 | 7.86,16.09 7.86,17.31 7.87,17.32 U2.2 | 8.26,1.54 U4.12 | v30.39,2.84 JP4.5 | 15.55,11.6 15.8,11.6 PROC.20 | v32.38,8.79 JP2.10 | v12.44,3.92 11.97,4.36 U4.21 | 14.58,2.44 14.2,2.44 13.81,2.44 13.29,2.44 | v21.07,13.85 20.26,13.5 20.17,13.48 20.17,12.68 20.71,12.28 22.14,12.28 22.4,12.8 PROC.9 | U4.31 7.27,6.88 7.26,6.88 | 7.26,6.88 | 7.26,6.88 U4.31 | 33.07,16.31 v33,16.01 | U4.P$1 8.5,4.21 7.4,5.31 | U4.3 7.05,4.96 7.4,5.31 | U4.7 7.55,2.96 7.6,3.01 7.6,3.3 7.76,3.46 | 7.76,3.46 U4.6 | U4.P$1 7.76,3.46 | 8.26,1.54 8.26,3.96 U4.P$1
  Bottom 0.254: 6.13,4.35 6.16,4.35 | 6.13,4.35 C5.2 6.04,4.27 C3.2 5.42,5.86 4.36,5.86 v4.09,5.78 1.18,7.14 1.18,11.97 1.52,12.42 1.54,12.49 U9.3 1.52,16.82 0.93,16.81 v0.93,16.83 0.73,17.16 0.73,18.94 C24.2 C25.2 3.62,18.93 3.63,18.94 C26.2 4.7,19.12 4.91,19.1 6.4,19.09 C17.2 C16.2 9.13,18.95 9.15,18.96 | 12.01,7.73 12.02,9.32 12.25,9.77 13.36,9.77 13.62,9.35 R15.2 14.02,6.99 R14.2 14,5.79 13.9,5.79 R12.2 | 12.01,7.73 11.52,7.72 C21.2 11.07,7.24 v11.16,6.59 11.16,5.6 11.47,4.91 11.65,4.23 v12.44,3.92 | v31.54,18.95 31.18,19.15 9.71,19.14 9.3,18.96 C15.2 9.15,18.96 | C27.2 30.6,7.01 v32.38,8.79 v32.47,10.36 32.27,10.55 32.27,11.76 32.34,11.82 32.34,12.83 v32.38,12.87 32.38,14.92 C1.1 31.8,14.92 32.13,15.25 v33,16.01 | -2,18.9 -2.31,19.35 -5.67,19.35 -6.12,18.9 -6.12,13.71 -5.57,13.08 R2.1 -4.92,11.62 -4.72,11.42 -4.74,8.96 -5.25,8.62 -5.24,5.12 -4.88,4.92 -4.38,4.92 -4.26,4.91 C12.1 -3.12,4.85 -3.38,5.12 -3.4,5.12 -3.4,5.38 -3.41,5.38 C2.1 -2.71,6.44 -2.71,8.75 -2.62,8.81 -2.23,8.81 v-1.42,9.4 | -2,18.9 | -2,18.9 -2,18.36 -2.26,18.1 -2.41,18.05 -3.08,18.06 -3.24,18.05 -3.44,18.27 -4.06,18.27 v-5,17.1 -4.81,16.7 R4.1 | C22.2 9.53,9.27 9.45,9.35 9.45,10.81 9.79,11.06 v10.87,11.06 11.4,11.06 11.56,10.91 C29.1 12.44,10.91 12.48,10.95 C14.2 12.48,13.35 12.43,13.38 C28.2 | C8.2 6.75,13.63 9.29,13.63 v9.61,14.27 9.75,14.22 10.95,13.15 v10.95,12.13 | 6.13,4.35 C6.2 | C22.2 8.74,9.08 8.34,8.52 8.14,8.49 8.1,8.49 v8.27,8.36 7.37,7.46 | 30.65,4.01 30.39,3.75 v30.39,2.84 30.36,2.82 | 30.65,4.01 | 30.65,4.01 v32.64,4.01 | C22.2 10.81,7.69 12.01,7.73 | 7.37,7.46 7.11,7.2 5.17,7.2 C4.2 4.45,7.9 4.19,8.16 4.19,8.49 4.52,8.82 v4.71,8.83
  Bottom 0.254: 7.37,7.46 | C9.2 6.21,11.67 C10.2 6.72,11.69 6.75,11.72 C8.2 | v31.32,17.52 30.96,17.29 22.6,17.29 22.31,17.32 21.97,17.03 21.3,17.04 C23.2 20.85,16.75 20.82,16.39 20.82,14.87 | 20.82,14.87 20.84,14.48 22.16,14.48 U5.7 21.06,14.48 21.07,14.05 v21.07,13.85 | 20.82,14.87 | C8.2 6.15,12.92 5.89,13.18 5.89,14.38 C7.1 | 30.36,2.82 | C18.2 30.36,2.82 | 9.15,18.96 | v23.29,1.32 23.52,1.47 C13.2
INT1  (via drill 0.25 pad 0.66)
  Top 0.127: v21.42,5.88 21.42,4.76 21.68,4.5 23.4,4.5 PROC.42 | v10.9,10.27 10.59,10.57 10.36,10.73 9.65,10.73 9.41,10.39 U3.12
  Bottom 0.127: v10.9,10.27 11.46,10.25 11.59,10.15 14.75,10.14 15.36,11.22 15.99,11.22 18.36,11.23 19.24,10.4 20.92,8.89 20.93,8.28 21.43,7.89 v21.42,5.88
INT2  (via drill 0.25 pad 0.66)
  Top 0.127: v15.19,1.85 15.19,0.59 15.47,0.2 23.42,0.2 23.9,0.51 PROC.43
  Bottom 0.127: v15.19,1.85 14.75,2.27 13.61,2.27 10.96,2.28 10,3.21 10.01,6.08 9.78,6.31 3.81,6.31 1.6,7.49 1.6,11.94 1.92,12.2 2.08,12.4 2.13,12.43 3.42,12.42 U9.1
INT3  (via drill 0.25 pad 0.66)
  Top 0.127: v21.98,5.31 24.13,5.31 24.4,5.05 PROC.44 | v10.88,14.21 10.88,14.53 11.31,14.96 U8.8
  Bottom 0.127: v10.88,14.21 11.22,14.65 18.87,14.66 18.87,13.06 19.23,13.06 19.63,12.67 19.63,11.1 20.53,10.34 21.61,10.35 22.07,9.92 22.07,7.05 21.98,6.77 v21.98,5.31
INT4  (via drill 0.25 pad 0.66)
  Top 0.127: v11.97,5.96 11.56,5.96 U4.24 | v19.72,6.92 24.57,6.89 24.84,6.62 24.84,3.55 PROC.45
  Bottom 0.127: v19.72,6.92 18.74,8.13 17.14,8.15 15.99,7.21 15,6.44 14.99,4.99 14.63,4.62 14.63,3.55 14.36,3.17 13.53,3.27 13.23,3.28 13,3.51 13,3.53 12.94,4.32 12.04,4.63 v11.97,5.96
MCLR  (via drill 0.25 pad 0.66)
  Top 0.127: v21.63,10.98 22.12,10.35 25.12,10.35 25.36,10.73 25.36,11.53 23.4,13.49 PROC.7 | v9.79,15.57 11.32,16.18 12.32,17.39 JP3.5
  Bottom 0.127: R9.1 22.12,11 22.1,10.99 21.64,11 v21.63,10.98 21.5,10.99 20.76,11.75 20.2,12.36 20.2,13.16 19.68,13.83 19.45,13.83 19.47,13.82 19.46,15.21 10,15.21 9.79,15.38 v9.79,15.57
N$1  (via drill 0.25 pad 0.66)
  Top 0.127: v27.22,8.31 27.22,8.84 27.48,9.1 PROC.56
  Bottom 0.127: v27.22,8.31 C27.1
N$2  (via drill 0.25 pad 0.66)
  Top 0.127: v29.39,15.36 29.92,14.94 29.92,13.99 29.77,13.82 24.16,13.82 23.9,14.09 PROC.6
  Bottom 0.127: v29.39,15.36 29.5,15.2 U5.1
N$3  (via drill 0.25 pad 0.66)
  Top 0.127: v13.79,4.72 13.79,4.93 13.79,4.97 LED3.C
  Bottom 0.127: v13.79,4.72 13.51,4.73 R12.1
N$6
  Top 0.127: PROC.29 15.95,7.1 LED3.A
N$7  (via drill 0.25 pad 0.66)
  Top 0.127: v11.89,7.01 12.03,7.15 LED2.C
  Bottom 0.127: v11.89,7.01 12.03,6.89 R14.1
N$8  (via drill 0.25 pad 0.66)
  Top 0.127: v12.88,9.15 13.24,8.81 LED1.C
  Bottom 0.127: v12.88,9.15 12.71,8.98 R15.1
N$9
  Top 0.127: PROC.28 15.43,7.6 LED2.A
N$11
  Top 0.127: LED1.A 15,8.1 15.97,8.1 PROC.27
N$14  (via drill 0.25 pad 0.66)
  Top 0.127: R1.2 -3.67,8.41 -4.06,7.94 -4.89,6.9 -5.43,6.89 -5.68,6.94 v-5.67,9.18 | Q1.1 -5.29,6.67
  Top 0.254: Q1.1 -5.43,6.76 -5.43,6.89
  Bottom 0.254: v-5.67,9.18 -5.57,9.29 R2.2
N$16  (via drill 0.25 pad 0.66)
  Top 0.127: v-4.65,8.14 -4.66,7.95
  Top 0.305: -4.66,7.95 Q1.3 | v-4.53,6.26 -4.88,6.26 -5.97,6.25 -6.22,5.92 -6.21,4.71 -5.88,4.49 JP6.2
  Bottom 0.127: -1.02,15.91 D1.2 | v-4.65,8.14 -4.56,7.99
  Bottom 0.254: v-4.65,8.14 -4.47,8.06 -4.2,8.33 -4.21,16.79 -2.47,16.79 -2.17,16.51 C11.2 -1.02,15.91
  Bottom 0.305: -4.56,7.99 R13.2 | v-4.53,6.26 -4.52,7.07 -4.63,7.34 v-4.65,8.14
N$19
  Top 0.305: JP7.1 -6.2,15.86 -6.2,17.84 -5.96,18.2 -3.33,18.2 -3.05,17.84 -3.04,13.32 -4.35,12.02 U7.1
N$20
  Top 0.305: JP7.2 -6.14,14.86 -6.14,10.4 -5.93,10.14 U7.4
N$21
  Top 0.127: JP3.1 16.16,17.45 16,17 16,13.09 PROC.17
N$23  (via drill 0.25 pad 0.66)
  Top 0.127: v5.88,8.74 5.89,8.27 6.29,8.1 6.15,8.16 7.13,7.73 8.25,7.27 U4.29
  Bottom 0.127: v5.88,8.74 5.97,8.73 6.47,8.49 C4.1
N$24
  Top 0.127: PROC.18 15.72,12.6 15.68,12.87 15.68,16.88 15.33,17.19 JP3.2
N$25  (via drill 0.25 pad 0.66)
  Top 0.127: v-1.27,10.46 -1.45,10.64 | -1.45,10.64 | -1.45,10.64 U7.6 | v-2.78,18.71 -2.65,18.51 -2.62,18.48 -2.62,13.09 -2.79,12.92 v-2.79,12.42
  Bottom 0.254: v-2.79,12.42 -2.79,10.72 -2.53,10.46 v-1.27,10.46 | v-2.78,18.71 -5.23,18.71 -5.63,18.36 -5.63,14.26 R3.2
N$26  (via drill 0.25 pad 0.66)
  Top 0.127: v-3.14,9.55 -2.46,9.54 -2.15,9.85 -2.15,9.86 U7.5
  Bottom 0.127: -3.53,16.1 -3.79,16.11 R4.2
  Bottom 0.254: -3.53,16.1 R3.1 -3.57,10.84 v-3.14,9.55
N$28  (via drill 0.25 pad 0.66)
  Top 0.127: U4.13 8.76,1.11 9,1.11 | 9,1.11 9.26,1.11 U4.14 | 9,1.11 9,0.85 9,0.7 10.99,0.7 13.5,0.71 v13.65,1
  Bottom 0.127: v13.65,1 12.88,1.01 10.98,1.01 9.03,2.96 8.79,2.95 C6.1
N$29  (via drill 0.25 pad 0.66)
  Top 0.127: v8,15.29 8.08,15.21 U3.20
  Bottom 0.127: v8,15.29 v7.99,15.29 C7.2
N$32  (via drill 0.25 pad 0.66)
  Top 0.127: v7.72,9.37 7.58,9.38 U3.10
  Bottom 0.127: v7.72,9.37 7.51,9.46 C9.1
N$42  (via drill 0.25 pad 0.66)
  Top 0.127: v29.36,14.36 29.23,14.08 24.9,14.08 PROC.4
  Bottom 0.127: v29.36,14.36 29.5,14.36 U5.2
N$43  (via drill 0.25 pad 0.66)
  Top 0.254: v2.53,5.32 2.34,5.23 BALUN.4
  Bottom 0.254: v2.53,5.32 3.24,4.83 3.24,4.38 C19.1
N$45  (via drill 0.25 pad 0.66)
  Top 0.127: v23.26,16.37 23.54,16.13 23.94,16.12 24.25,16.12 24.41,16.01 PROC.5
  Bottom 0.127: v23.26,16.37 22.35,16.37 22.13,16.18 22.11,16.16 22.11,16.17 U5.8
N$46  (via drill 0.25 pad 0.66)
  Top 0.254: v2.18,3.98 1.97,4.24 BALUN.3
  Bottom 0.254: v2.18,3.98 2.19,3.69 2.45,3.45 C20.1
N$47  (via drill 0.25 pad 0.66)
  Top 0.254: v5.1,5.27 5.37,4.51 U4.4
  Bottom 0.254: v5.1,5.27 4.52,5.25 4.48,5.15 C19.2
N$48  (via drill 0.25 pad 0.66)
  Top 0.127: v24.82,10.93 23.16,11 22.9,11.27 PROC.8
  Bottom 0.127: v24.82,10.93 27.87,10.93 28.2,11.21 U5.4
N$49  (via drill 0.25 pad 0.66)
  Top 0.254: v5.15,3.19 5.15,3.68 5.55,3.96 U4.5
  Bottom 0.254: v5.15,3.19 4.24,3.19 C20.2
N$50  (via drill 0.25 pad 0.66)
  Top 0.127: 10.88,9.63 10.88,7.39 10.59,7.11 U4.25 | 10.88,9.63 11.58,9.16 U10.3 | 10.88,9.63 v10.06,10.2
  Bottom 0.127: v10.06,10.2 10.08,9.98 10.08,9.58 C22.1
N$51  (via drill 0.25 pad 0.66)
  Top 0.127: U4.26 9.76,7.52 9.86,7.72 9.7,7.79 v9.11,8.42 9.76,7.74 U10.1
  Bottom 0.127: v9.11,8.42 9.64,7.82 C21.1
N$52
  Top 0.254: 0.65,4.51 0.66,4.51
  Top 0.406: 0.65,4.51 0.65,4.26 U11.P$1 1.29,3.16 2.1,2.51 2.15,2.41 U12.SIG | 0.66,4.51 BALUN.1
N$57  (via drill 0.25 pad 0.66)
  Top 0.127: v32.73,1 32.73,0.47 32.47,0.21 | 32.47,0.21 | 32.47,0.21 26.66,0.21 26.39,0.47 JP4.1
  Bottom 0.127: C13.1 25.56,0.73 27.28,0.73 | v32.73,1 32.46,0.73 27.28,0.73 | 27.28,0.73 R10.1
N$62
  Top 0.127: PROC.21 18,11.1 18.27,11.37 18.26,13.94 17.64,14.7 17.65,16.14 17.37,16.42 17.37,17.04 16.85,17.62 16.85,19.32 16.77,19.44 12.33,19.44 11.67,19.44 11.43,19.45 11.32,19.17 JP3.6
OSC1  (via drill 0.25 pad 0.66)
  Top 0.127: v33.97,19.31 33.89,19.31 33.66,19.54 33.46,19.68 30.89,19.68 30.26,19.13 U6.3 | v32.91,1.89 32.15,1.89 31.89,1.63 31.89,0.48 27.39,0.48 JP4.2 | v21.66,1.47 21.9,1.7 PROC.39 | v32.67,5.38 32.91,5.38 32.91,9.52 32.64,9.79 JP2.12
  Bottom 0.127: v33.97,19.31 33.97,5.74 33.78,5.55 33.78,5.38 | 33.78,5.38 33.78,2.19 33.53,1.9 33.52,1.89 v32.91,1.89 33.49,1.35 33.49,0.74 33.46,0.71 33.25,0.47 22.58,0.47 v21.66,1.47 | 33.78,5.38 v32.67,5.38
OSC2
  Top 0.127: PROC.40 22.38,1.23 22.09,0.94 17.41,0.94 JP9.2
PWM1  (via drill 0.25 pad 0.66)
  Top 0.127: R1.1 -0.08,8.4 0.2,8.61 JP5.4 v3.4,8.61 v3.4,8.62 | v19.09,12.3 19.09,11.91 19.43,11.57 20.5,10.21 20.85,10.19 21.27,9.74 25.63,9.74 25.88,10.21 25.88,10.84 26.14,11.1 PROC.60
  Bottom 0.127: v19.09,12.3 18.6,12.73 18.57,14.38 11.74,14.38 11.48,14.17 11.48,11.86 11.22,11.6 9.03,11.6 8.77,11.34 8.77,10.62 8.31,10.18 8.31,9.19 8.05,8.84 7.11,8.84 6.64,9.26 5.28,9.26 5.11,9.5 4.29,9.5 v3.4,8.62
PWM1H  (via drill 0.25 pad 0.66)
  Top 0.127: PROC.61 29.34,11.57 v29.97,11.82 | v26.86,16.67 26.41,17.13 26.2,17.32 26.2,17.5 26.2,17.88 JP10.9
  Bottom 0.127: v29.97,11.82 30.54,12.31 30.52,13.49 30.35,13.6 30.35,15.83 29.43,16.54 27.54,16.54 27.41,16.67 v26.86,16.67
PWM2  (via drill 0.25 pad 0.66)
  Top 0.127: U7.7 -0.57,11.14 -0.04,10.61 JP5.2 2.48,10.61 v2.82,10.51 | v20.54,11.1 21.56,10.06 25.36,10.06 25.62,10.47 25.62,11.84 25.88,12.1 PROC.62
  Bottom 0.127: v20.54,11.1 19.89,11.88 19.89,12.92 19.88,12.94 19.89,12.95 19.34,13.48 19.17,13.47 19.14,13.49 19.14,14.93 19.12,14.94 9.51,14.95 8.93,15.83 7.08,15.83 6.28,15.03 4.91,15.03 4.82,14.77 4.82,10.87 4.38,10.61 | 4.38,10.61 | v2.82,10.51 4.38,10.61
PWM2H  (via drill 0.25 pad 0.66)  (1 unrouted)
  Top 0.127: PROC.63 29.55,12.59 v29.99,12.82 | v26.05,16.62 25.2,17.31 JP10.8 | 25.3,18.32 25.19,18.38 25.19,18.4
  Bottom 0.127: v29.99,12.82 29.99,14.35 29.99,15.49 29.97,15.63 29.72,15.88 29.18,16.25 27.45,16.25 27.3,16.14 26.54,16.14 26.36,16.42 v26.05,16.62
PWM3  (via drill 0.25 pad 0.66)
  Top 0.127: v32.44,18.74 32.73,18.35 32.74,17.17 32.55,16.97 31.76,16.98 30.99,16.98 30.8,16.7 30.79,16.49 30.53,16.22 30.53,14.12 29.51,13.1 PROC.64 | JP5.1 -0.12,11.61 -0.29,11.78 v-0.82,11.78 -1.4,11.78 -1.54,11.64 U7.8
  Bottom 0.127: v-0.82,11.78 0.08,11.78 0.34,12.04 0.34,19.25 0.75,19.65 32.2,19.67 32.45,19.46 32.44,19.45 v32.44,18.74
PWM3H
  Top 0.127: JP8.1 2.13,15.88 2.79,16.39 2.79,19.44 3.06,19.74 29.18,19.73 29.39,19.43 29.39,17.56 29.38,17.04 29.14,16.8 28.74,16.42 28.74,15.63 28.45,15.15 27.58,15.16 27.1,15.16 PROC.1
PWM4
  Top 0.127: PROC.2 25.91,15.17 25.89,16.01 25.45,16.42 24.88,16.42 24.19,16.86 24.19,17 JP10.7
PWM4H
  Top 0.127: PROC.3 25.4,16.01 25.27,16.14 24.71,16.14 24.36,16.37 23.2,17.12 JP10.6
RB15  (via drill 0.25 pad 0.66)
  Top 0.127: v18.33,6.23 17.94,6.6 PROC.30 | v6.16,1.05 7.75,1.05 U4.11
  Bottom 0.127: v6.16,1.05 6.89,0.47 18.06,0.47 19.25,0.48 19.43,0.67 19.4,3.71 18.84,4.27 18.84,4.69 18.25,5.21 18.26,5.68 18.34,5.76 v18.33,6.23
RC13  (via drill 0.25 pad 0.66)
  Top 0.127: v25.9,6.88 | PROC.47 v25.9,6.88 | v29.89,10.87 30.25,11.27 30.43,11.27 30.61,11.44 30.61,11.69 30.86,11.95 30.86,12.46 31.05,12.73 JP2.18
  Bottom 0.127: v29.89,10.87 29.73,10.58 29.73,10.09 29.57,9.86 29.18,9.34 26.16,9.32 25.9,9.06 v25.9,6.88
RC14  (via drill 0.25 pad 0.66)
  Top 0.127: v27.63,3.9 27.62,3.9 27.39,3.54 26.42,3.54 PROC.48 | v32.74,3.22 33,3.48 33.43,3.48 33.69,3.74 33.77,3.82 33.77,12.1 33.43,12.29 JP2.17
  Bottom 0.127: v32.74,3.22 33.17,3.65 33.17,4.28 32.91,4.54 28.27,4.54 v27.63,3.9
RD0  (via drill 0.25 pad 0.66)
  Top 0.127: v32.18,2.66 32.11,2.73 32.11,6.79 JP2.6 | v25.36,5.39 25.4,5.37 PROC.46
  Bottom 0.127: v25.36,5.39 28.02,5.39 28.57,4.84 | 28.57,4.84 | 28.57,4.84 33.17,4.84 33.43,4.58 | 33.43,4.58 | 33.43,4.58 33.43,2.92 33.17,2.66 v32.18,2.66
RD1
  Top 0.127: PROC.49 29.81,5.6 29.99,5.79 JP2.4
RD2
  Top 0.127: PROC.50 27.5,6.1 27.5,5.29 27.75,5.15 27.76,5.15 29.25,5.15 29.51,5.29 JP2.3
RD3
  Top 0.127: PROC.51 29.75,6.6 30.07,6.29 JP2.5
RD4
  Top 0.127: JP2.7 30.53,7.29 30.35,7.1 PROC.52
RD5
  Top 0.127: JP2.9 31.03,8.27 30.38,7.6 PROC.53
RD6
  Top 0.127: JP2.11 31.13,9.26 30.84,8.96 30.84,8.67 30.34,8.12 PROC.54
RD7
  Top 0.127: JP2.13 31.09,10.28 30.91,10.11 30.92,9.66 30.21,8.6 PROC.55
RF0
  Top 0.127: PROC.58 30.15,10.1 30.89,11.1 30.89,11.53 30.89,11.6 30.99,11.69 JP2.16
RF1  (via drill 0.25 pad 0.66)
  Top 0.127: v25.36,8.53 26.14,9.3 26.14,10.34 26.4,10.6 PROC.59 | v32.38,7.79 | v32.38,7.79 JP2.8
  Bottom 0.127: v32.38,7.79 32.38,6.45 32.12,6.19 25.63,6.19 25.36,6.45 | 25.36,6.45 | 25.36,6.45 v25.36,8.53
SCK1
  Top 0.127: U4.19 11.75,3.36 12.57,2.77 16.04,2.77 16.55,3.39 18.01,3.39 18.26,3.14 18.26,2.5 18.5,2.35 19.59,2.35 19.62,2.38 19.9,2.61 PROC.35
SCL1  (via drill 0.25 pad 0.66)
  Top 0.127: v24.14,6.36 24.1,6.4 21.16,6.4 20.9,6.13 PROC.37 | v33.44,13.88 33.35,13.79 | 33.35,13.79 | 33.35,13.79 JP2.20 | v14.76,9.34 14.49,9.34 13.3,10.26 U8.14 | v19.17,9.2 22.33,9.2 22.65,8.88 v24.15,8.88
  Bottom 0.127: v24.14,6.36 24.14,5.66 24.4,5.39 24.75,5.39 24.75,3.29 R5.1 | v24.14,6.36 24.68,6.36 25.11,5.93 33.18,5.93 33.44,6.19 v33.44,13.88 | v14.76,9.34 17.68,9.34 18.94,9.33 v19.17,9.2 | v24.14,6.36 v24.15,8.88
SCL2  (via drill 0.25 pad 0.66)
  Top 0.127: v4.14,7.38 4.14,11.94 3.88,12.2 3.68,12.57 3.15,12.57 2.74,12.16 0.64,12.16 0.34,12.46 0.34,13.85 0.6,14.11 3.72,14.11 4.54,14.94 6.58,14.94 U3.23 | v18.16,7.46 18.47,7.46 18.76,7.76 19.94,7.76 20.21,8.03 21.71,8.03 21.89,8.15 22.97,8.15 22.99,8.14 v23.11,7.99 | v15.58,6.15 15.58,5.87 15.97,5.6 PROC.32 | v28.68,2.84 29.39,2.84 JP4.4
  Bottom 0.127: v4.14,7.38 4.64,6.86 10.14,6.86 10.55,6.55 10.56,3.72 11.56,2.88 14.66,2.88 14.9,3.22 14.89,4.46 15.25,4.86 15.26,5.28 15.57,5.59 v15.58,6.15 15.58,6.38 16.17,6.85 16.85,7.46 v18.16,7.46 | v4.14,7.38 | 24.23,3.83 24.49,4.09 24.49,5.13 23.37,5.13 23.11,5.39 v23.11,7.99 | 24.23,3.83 20.64,3.83 R8.1 | 24.23,3.83 24.49,3.83 24.49,3 24.75,2.74 | 24.75,2.74 | 24.75,2.74 28.58,2.74 v28.68,2.84
SDA1  (via drill 0.25 pad 0.66)
  Top 0.127: v34.31,5.1 34.31,14.52 34.05,14.79 JP2.22 | PROC.36 20.4,2.38 20.4,2.25 v20.4,2.08 18.38,2.09 17.97,2.39 17.97,2.62 v17.66,2.85 | v15.79,4.21 15.29,4.57 14.57,5.26 14.16,5.26 13.87,5.46 13.87,6.48 14,6.61 13.98,9.05 13.02,9.83 12.16,9.83 11.4,10.49 11.4,10.97 U8.13
  Bottom 0.127: v34.31,5.1 34.31,0.47 34.05,0.21 22.01,0.21 20.6,1.51 20.39,1.72 v20.4,2.08 21.03,2.08 20.91,2.08 23.58,2.08 23.85,2.39 R6.1 | v17.66,2.85 17.68,4.55 17.36,5.01 16.7,5.01 16.14,4.21 v15.79,4.21
SDA2  (via drill 0.25 pad 0.66)
  Top 0.127: JP4.3 28.16,1.58 28.16,4.23 27.98,4.43 26.78,4.43 26.43,4.76 26.43,7.16 26.18,7.43 22.93,7.43 22.82,7.5 19.38,7.5 19.05,6.98 19.04,5.78 v18.84,5.52 18.14,5.52 17.89,5.78 17.57,6.1 PROC.31 | v0.93,12.71 2.68,12.71 4.39,14.39 U3.24
  Bottom 0.127: 19.81,2.61 19.81,0.57 19.65,0.21 6.31,0.21 5.52,0.77 5.52,1.61 5.36,1.82 5.36,2.47 5.18,2.57 3.93,2.58 3.7,2.81 3.7,3.81 3.85,4.06 3.85,5.26 0.78,6.97 0.73,12.59 0.87,12.73 v0.93,12.71 | 19.81,2.61 21.94,2.61 R7.1 | v18.84,5.52 19.1,5.22 19.1,4.51 19.8,3.91 19.81,2.61
SDI1
  Top 0.127: PROC.34 19.41,2.71 19.27,2.61 18.69,2.61 18.54,2.7 18.54,3.49 18.31,3.65 16.41,3.65 15.92,3.04 12.69,3.04 11.65,3.86 11.49,3.96 U4.20
SDO1
  Top 0.127: PROC.33 18.85,3.85 18.83,3.94 17.97,3.94 16.31,3.94 15.75,3.33 13.58,3.33 13.25,3.67 13.25,4.06 12.35,4.96 U4.22
SS1  (via drill 0.25 pad 0.66)
  Top 0.127: v13.83,3.89 13.81,3.89 13.61,4.1 13.14,4.58 12.44,5.38 11.34,5.38 11.01,5.38 U4.23 | v18.14,10.51 18.27,10.62 18.53,10.8 18.53,12.8 19.89,14.16 PROC.14
  Bottom 0.127: v18.14,10.51 16.69,10.51 16.17,9.86 14.42,9.88 14.16,9.62 14.16,9.15 14.7,8.61 14.71,5.07 14.33,4.69 14.32,4.27 v13.83,3.89
VCC  (via drill 0.25 pad 0.66)
  Top 0.178: v10.58,16.51 10.57,17.05 10.67,17.18 10.67,19.43 7.6,19.43 7.37,19.2 U2.6 | v30.15,9.51 30.91,10.66 JP2.14 | v32.25,16.42 32.32,16.53 32.23,16.56 31.65,16.57 v31.36,16.44 31.2,16.35 30.86,16.01 30.84,14.48 31.01,14.3 JP2.21
  Bottom 0.178: C17.1 6.64,16.92 7,16.53 10.5,16.52 v10.58,16.51 13.05,17.19 13.58,17.62 21.63,17.6 21.93,17.6 22.06,17.67 25.37,17.65 30.41,17.68 30.41,17.72 30.85,18.08 31.77,18.07 v32.25,16.42 | v30.15,9.51 30.35,9.15 31.11,9.15 31.5,9.54 C1.2 30.71,13.91 30.73,15.88 31.2,16.35 v31.36,16.44
VDD  (via drill 0.25 pad 0.66)
  Top 0.254: v5.25,10.14 5.25,9.57 5.66,9.57 6.58,9.57 6.58,8.76 | 6.58,8.76 6.58,9.83 U3.8 | v13.16,16.13 12.57,16.13 11.97,15.63 11.24,15.63 10.25,14.7 10.25,13.13 10.15,13.01 v10.15,12.39 10.15,11.4 9.89,11.14 U3.13 | v18.89,1.49 20.01,1.48 20.3,1.28 20.64,1.28 21.4,2.18 PROC.38 | U8.1 15.37,10.97 15.37,8.87 15.63,8.6 PROC.26 17.64,8.61 18.12,8.1 19.64,8.1 20.24,8.58 v21.52,8.58 | v20.99,13.02 21.9,13.07 PROC.10 | U4.28 8.76,7.46 7.16,8.13 6.94,8.23 6.58,8.43 6.58,8.76 | PROC.19 17.91,12.11 17.9,13.35 v17.63,13.81 17.22,14.53 17.2,15.98 v16.74,16.9 | v13.99,1.74 13.94,1.72 13.3,1.72 12.95,1.03 10.67,1.04 9.76,1.04 U4.15 | JP4.6 31.32,1.58 31.32,3.31 v31.25,3.37 30.98,3.37 30.78,3.57 v29.55,3.57 29.54,4.5 29.27,4.79 27.08,4.79 26.83,5.02 26.83,7.46 26.34,7.95 26.34,8.76 v27.24,9.9 27.61,9.61 28.45,9.61 PROC.57 | v13.16,16.13 13.23,16.06 13.23,15.07 U8.7 | v6.07,1.83 6.03,1.95 U4.8 | v27.44,18.22 27.59,18.23 U6.4 | v13.16,16.13 13.33,16.5 JP3.4 | v4.33,16.02 4.46,16.03 4.46,16.98 4.72,17.24 U1.6 | v18.2,16.81 17.42,17.56 v17.37,18.2
  Bottom 0.127: 2.07,10.86 2.1,10.91 | v5.25,10.14
  Bottom 0.254: 9.39,5.66 9.62,5.37 9.62,2.94 10.88,1.73 v13.99,1.74 14.58,1.09 14.96,1.1 18.33,1.1 18.65,1.29 v18.89,1.49 18.9,3.55 18.5,4.01 18.49,4.43 17.86,4.99 17.86,5.25 17.66,5.41 17.66,6.41 17.99,6.84 18.72,6.85 19.45,5.91 19.46,4.76 19.64,4.5 R8.2 R7.2 22.58,4.5 22.58,4.58 22.84,4.84 | 9.39,5.66 7.43,5.64 C5.1 6.79,3.76 6.79,2.22 6.51,1.97 6.26,1.84 v6.07,1.83 | 9.39,5.66 C3.1 | 22.84,4.84 23.1,4.59 R6.2 | v27.24,9.9 26.67,9.89 24.52,9.89 24.04,9.9 24.03,10.69 24.04,10.95 24.02,11.01 22.87,11.02 22.37,12.1 22.4,12.1 U5.5 21.06,12.11 v20.99,13.02 | 2.1,10.91 2.18,11.14 4.12,11.14 4.47,11.39 4.48,15.27 4.33,15.42 v4.33,16.02 3.25,16.02 3.08,16.21 3.09,17.39 2.98,17.5 C25.1 | 2.07,10.86 2.07,10.35 2.06,9.86 5.08,9.86 v5.25,10.14 5.69,9.6 6.83,9.6 6.84,10.73 6.98,11.06 7.98,11.06 C10.1 8.02,11.69 8.05,11.72 C8.1 9.63,12.92 v10.15,12.39 | R5.2 26.18,4.59 27.15,3.17 27.88,3.17 28.26,3.55 v29.55,3.57 29.54,1.76 29.27,1.49 R10.2 | v17.63,13.81 17.62,12.47 C14.1 13.73,12.26 13.78,12.49 17.57,12.48 19.25,10.91 19.24,10.91 19.26,10.9 21.53,8.91 v21.52,8.58 | v27.24,9.9 28.98,9.9 29.27,10.24 29.25,12.68 U5.3 | v20.99,13.02 20.8,13.06 20.6,13.26 20.07,14.04 20.1,16.9 20.05,16.92 v18.2,16.81 v16.74,16.9 13.95,16.92 v13.16,16.13 | v31.25,3.37 31.25,2.54 31.66,2.13 C18.1 | v20.99,13.02 21.1,13.1 22.4,13.1 U5.6 | 22.84,4.84 22.58,5.1 22.59,6.76 22.6,7.19 22.43,7.55 22.43,8.38 R9.2 24.02,9.88 24.59,9.89 24.86,9.89 v27.24,9.9 | 22.84,4.84 | C23.1 24.06,18.21 v27.44,18.22 27.23,18.21 v17.37,18.2
VEE  (via drill 0.25 pad 0.66)
  Top 0.178: v32.91,11.29 JP2.15 | v9.98,18.44 9.31,19.12 7.87,19.12 U2.5
  Bottom 0.178: C16.1 7.88,16.86 9.98,16.87 10.68,17.18 10.67,17.84 v9.98,18.44 13.85,18.44 14.17,18.76 26.89,18.78 30.85,18.79 31.26,18.43 31.33,18.4 31.87,18.41 32.29,18.06 33.46,18.05 33.59,17.88 33.62,17.72 33.62,15.21 32.89,14.49 32.85,13.45 32.99,13.31 32.99,12.53 32.91,12.45 v32.91,11.29
VPP  (via drill 0.25 pad 0.66)
  Top 0.178: JP8.2 2.78,14.87 3.04,15.13 3.04,15.94 v3.82,16.83 3.83,17.34 4.28,17.73 5.44,17.74 U1.5 | v14.66,15.75 14.6,15.68 14.6,14.97 U8.6 | v16.59,15.75 v16.62,13.82
  Bottom 0.178: 4.58,16.83 5.29,16.16 9.96,16.17 10.93,15.52 13.56,15.53 13.83,15.75 v14.66,15.75 v16.59,15.75 | 4.58,16.83 v3.82,16.83 | C26.1 4.58,16.83 | C29.2 13.08,10.89 13.12,13.56 C28.1 15.98,13.54 v16.62,13.82
(copper drawn outside any net)
  shapes: Top area x2

### Text on the board
tPlace: PROG | OB | PWM3H | GND | BAT+ | AN8 | MCLR | VDD | GND | AN7 | AN6 | AN0 | AN1 | AN3 | AN4 | AN5 | P4H | P4L | P2H | P1H | OA | VPP | PWM3L | PWM2L | BAT+ | PWM1L | AN5 | GND | MOT+ | AN10 | OSC2 | OSC1 | SDA2 | SCL2 | GND | VDD | MOT-
bPlace: UC Berkeley | ImageProc 2.2
tNames: U2 | U1
bDocu: GYRO | XL | RADIO | LED | I2C2 | I2C1 | WII